# Altium schematic sheet MiniMonitor_SCH.SchDoc
size A3
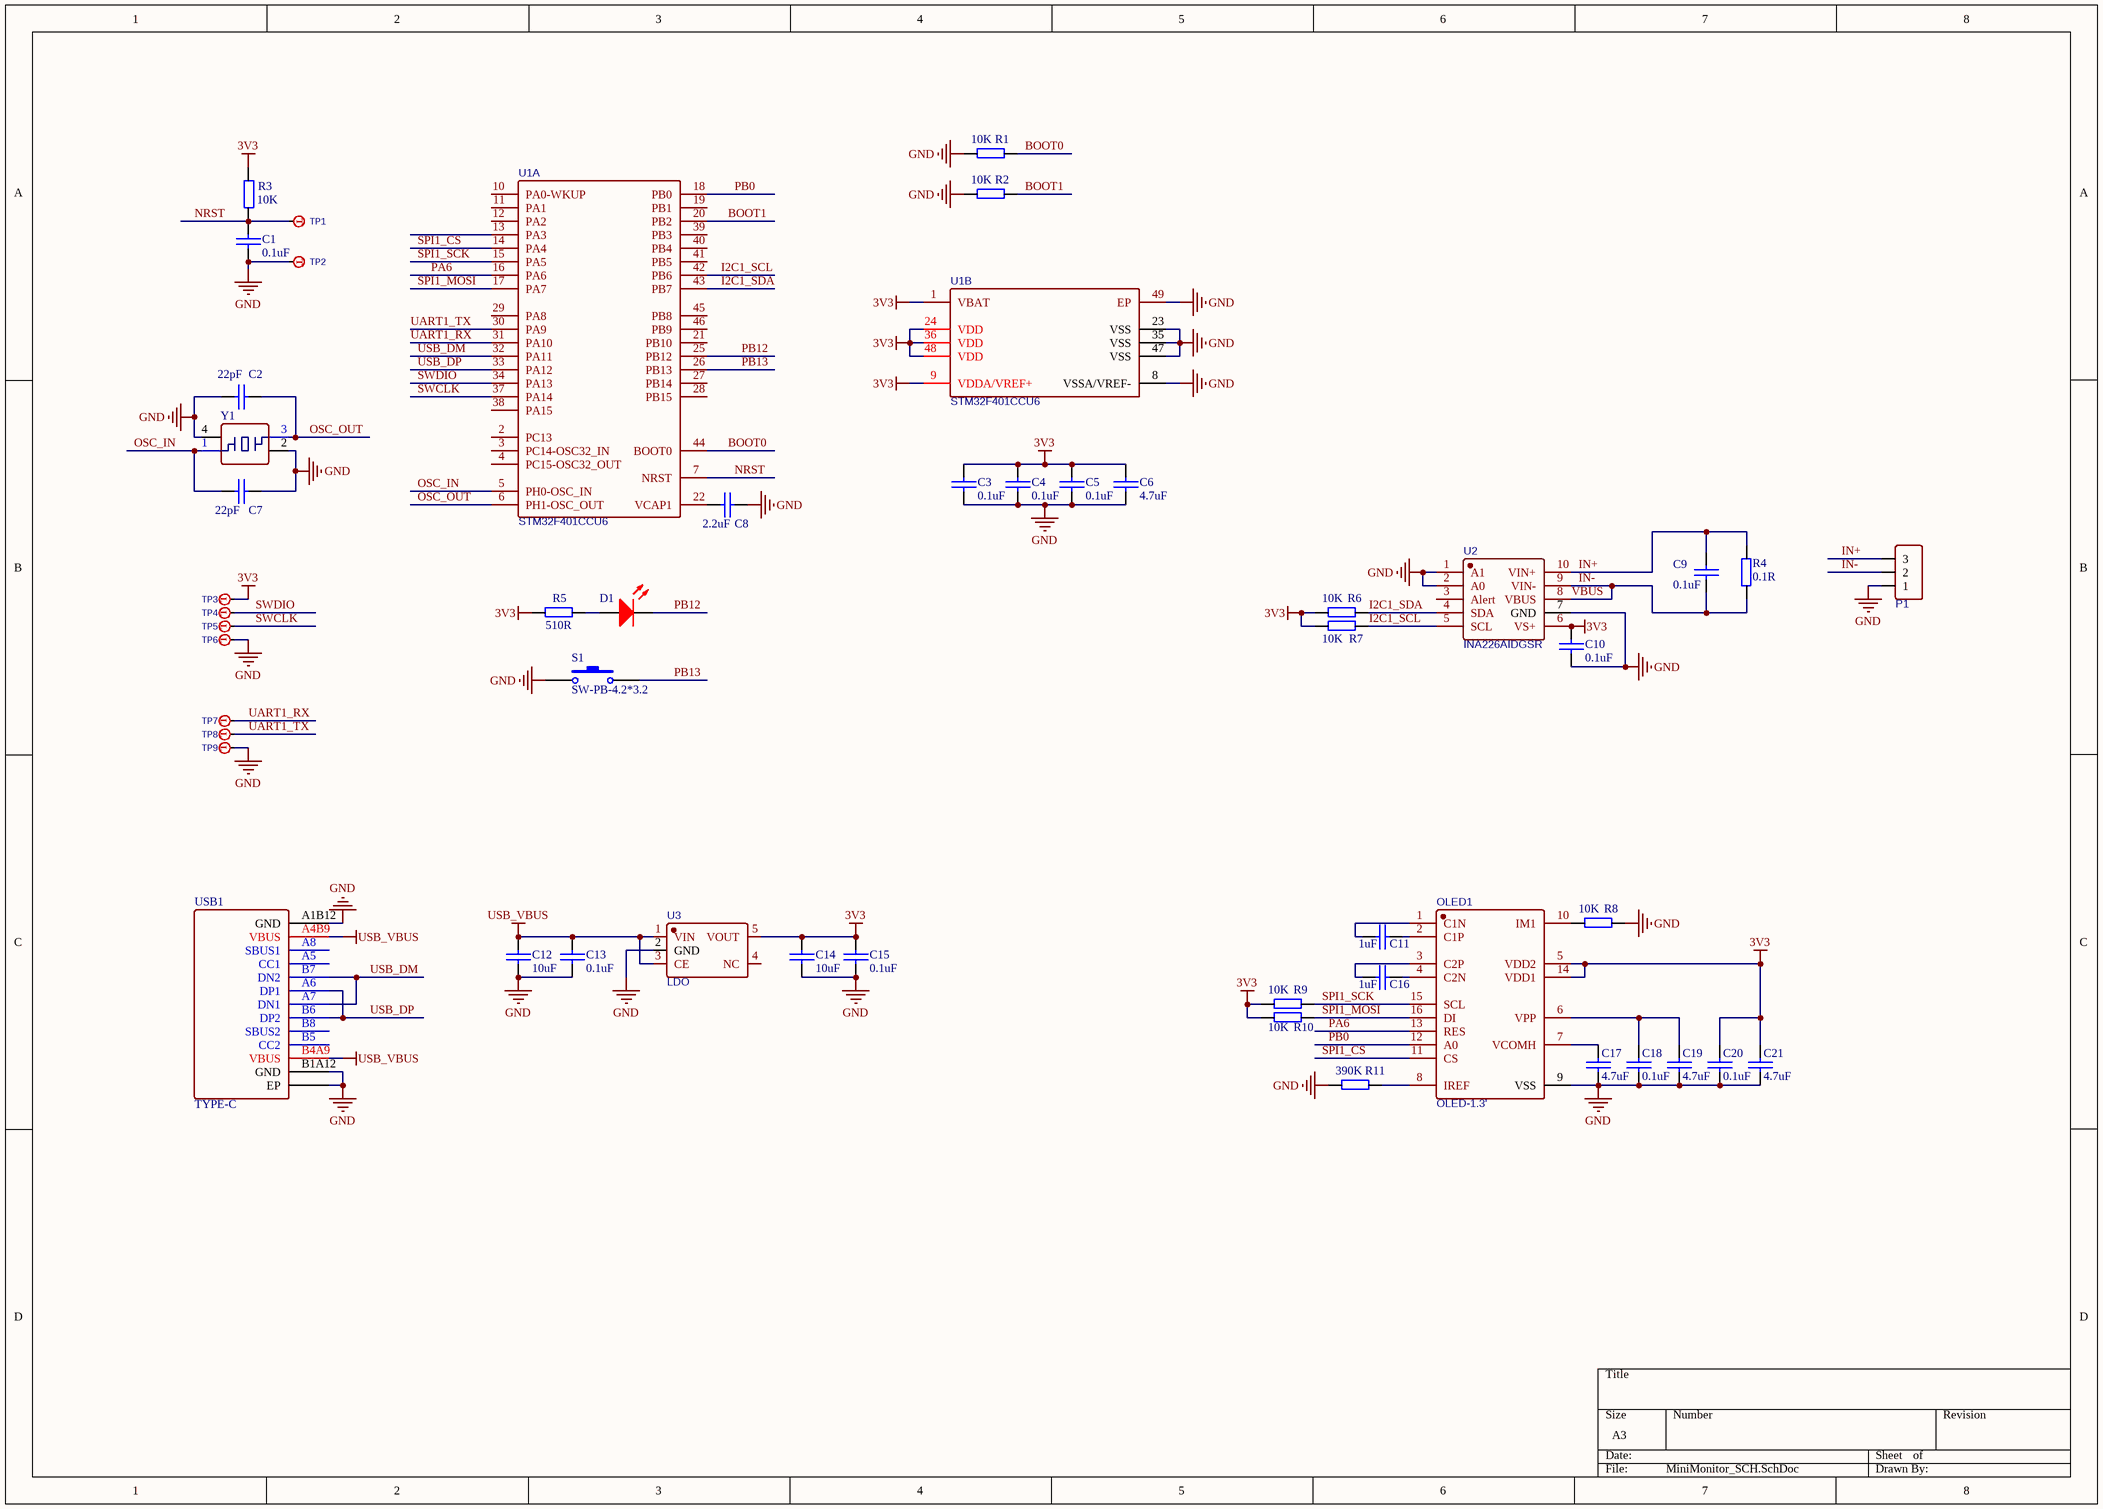
[diagram p0: MiniMonitor_SCH.SchDoc]

## Parts
C1  0.1uF  [LC-0603_C]
C2  22pF  [LC-0603_C]
C3  0.1uF  [LC-0603_C]
C4  0.1uF  [LC-0603_C]
C5  0.1uF  [LC-0603_C]
C6  4.7uF  [LC-0603_C]
C7  22pF  [LC-0603_C]
C8  2.2uF  [LC-0603_C]
C9  0.1uF  [LC-0603_C]
C10  0.1uF  [LC-0603_C]
C11  1uF  [LC-0603_C]
C12  10uF  [LC-0603_C]
C13  0.1uF  [LC-0603_C]
C14  10uF  [LC-0603_C]
C15  0.1uF  [LC-0603_C]
C16  1uF  [LC-0603_C]
C17  4.7uF  [LC-0603_C]
C18  0.1uF  [LC-0603_C]
C19  4.7uF  [LC-0603_C]
C20  0.1uF  [LC-0603_C]
C21  4.7uF  [LC-0603_C]
D1  LED_RED  [LC-0603_LED]  (value not drawn)
OLED1  OLED-1.3'  [OLED-1.3]
P1  HDR-F-2.54_1x3  [HDR1X3]  (value not drawn)
R1  10K  [LC-0603_R]
R2  10K  [LC-0603_R]
R3  10K  [LC-0603_R]
R4  0.1R  [R2512]
R5  510R  [LC-0603_R]
R6  10K  [LC-0603_R]
R7  10K  [LC-0603_R]
R8  10K  [LC-0603_R]
R9  10K  [LC-0603_R]
R10  10K  [LC-0603_R]
R11  390K  [LC-0603_R]
S1  SW-PB-4.2*3.2  [SW  4.2*3.2]
TP1  TEST  [TEST]  (value not drawn)
TP2  TEST  [TEST]  (value not drawn)
TP3  TEST  [TEST]  (value not drawn)
TP4  TEST  [TEST]  (value not drawn)
TP5  TEST  [TEST]  (value not drawn)
TP6  TEST  [TEST]  (value not drawn)
TP7  TEST  [TEST]  (value not drawn)
TP8  TEST  [TEST]  (value not drawn)
TP9  TEST  [TEST]  (value not drawn)
U1  STM32F401CCU6  [UFQFPN-48]  (parts A,B of 2)
U2  INA226AIDGSR  [MSOP10]
U3  LDO  [SOT23-5_S]
USB1  TYPE-C  [USB_TypeC2]
Y1  CY3225  [OSC_3225]  (value not drawn)

## Nets
3V3: C3.2 C4.2 C5.2 C6.2 C10.2 C14.2 C15.2 C20.2 C21.2 OLED1.5(VDD2) OLED1.14(VDD1) R3.2 R5.2 R6.2 R7.2 R9.2 R10.2 TP3.1 U1.1(VBAT) U1.9(VDDA/VREF+) U1.24(VDD) U1.36(VDD) U1.48(VDD) U2.6(VS+) U3.5(VOUT)
GND: C1.1 C2.1 C3.1 C4.1 C5.1 C6.1 C7.2 C8.2 C10.1 C12.1 C13.1 C14.1 C15.1 C17.1 C18.1 C19.1 C20.1 C21.1 OLED1.9(VSS) P1.1 R1.2 R2.2 R8.1 R11.2 S1.1 TP2.1 TP6.1 TP9.1 U1.8(VSSA/VREF-) U1.23(VSS) U1.35(VSS) U1.47(VSS) U1.49(EP) U2.1(A1) U2.2(A0) U2.7(GND) U3.2(GND) USB1.1(EP) USB1.A1B12(GND) USB1.B1A12(GND) Y1.2 Y1.4
USB_VBUS: C12.2 C13.2 U3.1(VIN) U3.3(CE) USB1.A4B9(VBUS) USB1.B4A9(VBUS)
BOOT0: R1.1 U1.44(BOOT0)
BOOT1: R2.1 U1.20(PB2)
I2C1_SCL: R7.1 U1.42(PB6) U2.5(SCL)
I2C1_SDA: R6.1 U1.43(PB7) U2.4(SDA)
IN+: C9.1 P1.3 R4.1 U2.10(VIN+)
IN-: C9.2 P1.2 R4.2 U2.8(VBUS) U2.9(VIN-)  [also labelled VBUS]
NRST: C1.2 R3.1 TP1.1 U1.7(NRST)
OSC_IN: C7.1 U1.5(PH0-OSC_IN) Y1.1
OSC_OUT: C2.2 U1.6(PH1-OSC_OUT) Y1.3
PA6: OLED1.13(RES) U1.16(PA6)
PB0: OLED1.12(A0) U1.18(PB0)
PB12: D1.K U1.25(PB12)
PB13: S1.2 U1.26(PB13)
SPI1_CS: OLED1.11(CS) U1.14(PA4)
SPI1_MOSI: OLED1.16(DI) R10.1 U1.17(PA7)
SPI1_SCK: OLED1.15(SCL) R9.1 U1.15(PA5)
SWCLK: TP5.1 U1.37(PA14)
SWDIO: TP4.1 U1.34(PA13)
UART1_RX: TP7.1 U1.31(PA10)
UART1_TX: TP8.1 U1.30(PA9)
USB_DM: U1.32(PA11) USB1.A7(DN1) USB1.B7(DN2)
USB_DP: U1.33(PA12) USB1.A6(DP1) USB1.B6(DP2)
NetC8_1: C8.1 U1.22(VCAP1)
NetC11_1: C11.1 OLED1.2(C1P)
NetC11_2: C11.2 OLED1.1(C1N)
NetC16_1: C16.1 OLED1.4(C2N)
NetC16_2: C16.2 OLED1.3(C2P)
NetC17_2: C17.2 OLED1.7(VCOMH)
NetC18_2: C18.2 C19.2 OLED1.6(VPP)
NetD1_A: D1.A R5.1
NetOLED1_8: OLED1.8(IREF) R11.1
NetOLED1_10: OLED1.10(IM1) R8.2

Not connected (* = marked no-connect by the designer): U1 2(PC13) 3(PC14-OSC32_IN) 4(PC15-OSC32_OUT) 10(PA0-WKUP) 11(PA1) 12(PA2) 13(PA3) 19(PB1) 21(PB10) 27(PB14) 28(PB15) 29(PA8) 38(PA15) 39(PB3) 40(PB4) 41(PB5) 45(PB8) 46(PB9); U2 3(Alert); U3 4(NC); USB1 A5(CC1) A8(SBUS1) B5(CC2) B8(SBUS2)

## Notes on the sheet
- (in symbol TEST) T

## Library data of the parts
C1-C21 = CAP
D1 = LED_RED: Typical INFRARED GaAs LED; Published: 8-Jun-2000; LatestRevisionDate: 08-Jul-2005; LatestRevisionNote: Mech Layer 1 removed.; PackageReference: LED-0; Publisher: Altium Limited; PackageDescription: LED; 2 Leads
OLED1 = OLED-1.3': BOM_Manufacturer: Shanghai Siproin Microelectronics; BOM_Manufacturer Part: SSP7603P33M5R; Contributor: LCSC; BOM_Supplier: LCSC; BOM_Supplier Part: C411031; BOM_JLCPCB Part Class: Extended Part; spicePre: U; spiceSymbolName: SSP7603P33M5R
P1 = HDR-F-2.54_1x3: Contributor: LCEDA_Lib; BOM_Supplier Part: C146690; BOM_Supplier: LCSC; spicePre: H; spiceSymbolName: HDR-F-2.54_1x3
R1-R11 = R
S1 = SW-PB-4.2*3.2: Switch; Published: 24-Mar-1999; LatestRevisionDate: 17-Jul-2002; LatestRevisionNote: Re-released for DXP Platform.; PackageReference: SPST-2; Publisher: Altium Limited; PackageDescription: Switch; 2 Leads
U1 = STM32F401CCU6: BOM_Manufacturer: ST; subpart_no: 2; tags: STM32; BOM_Supplier Part: C79861; BOM_Supplier: LCSC; BOM_Manufacturer Part: STM32F401CCU6; BOM_JLCPCB Part Class: Extended Part; spicePre: U; spiceSymbolName: STM32F401CCU6
U2 = INA226AIDGSR: BOM_Manufacturer: TI; BOM_Supplier: LCSC; BOM_Manufacturer Part: INA226AIDGSR; BOM_Supplier Part: C49851; BOM_JLCPCB Part Class: Extended Part; spicePre: U; spiceSymbolName: INA226AIDGSR
U3 = LDO: BOM_Manufacturer: Shanghai Siproin Microelectronics; BOM_Manufacturer Part: SSP7603P33M5R; Contributor: LCSC; BOM_Supplier: LCSC; BOM_Supplier Part: C411031; BOM_JLCPCB Part Class: Extended Part; spicePre: U; spiceSymbolName: SSP7603P33M5R